# Altium project RM2022拓展板V2.0.PrjPcb
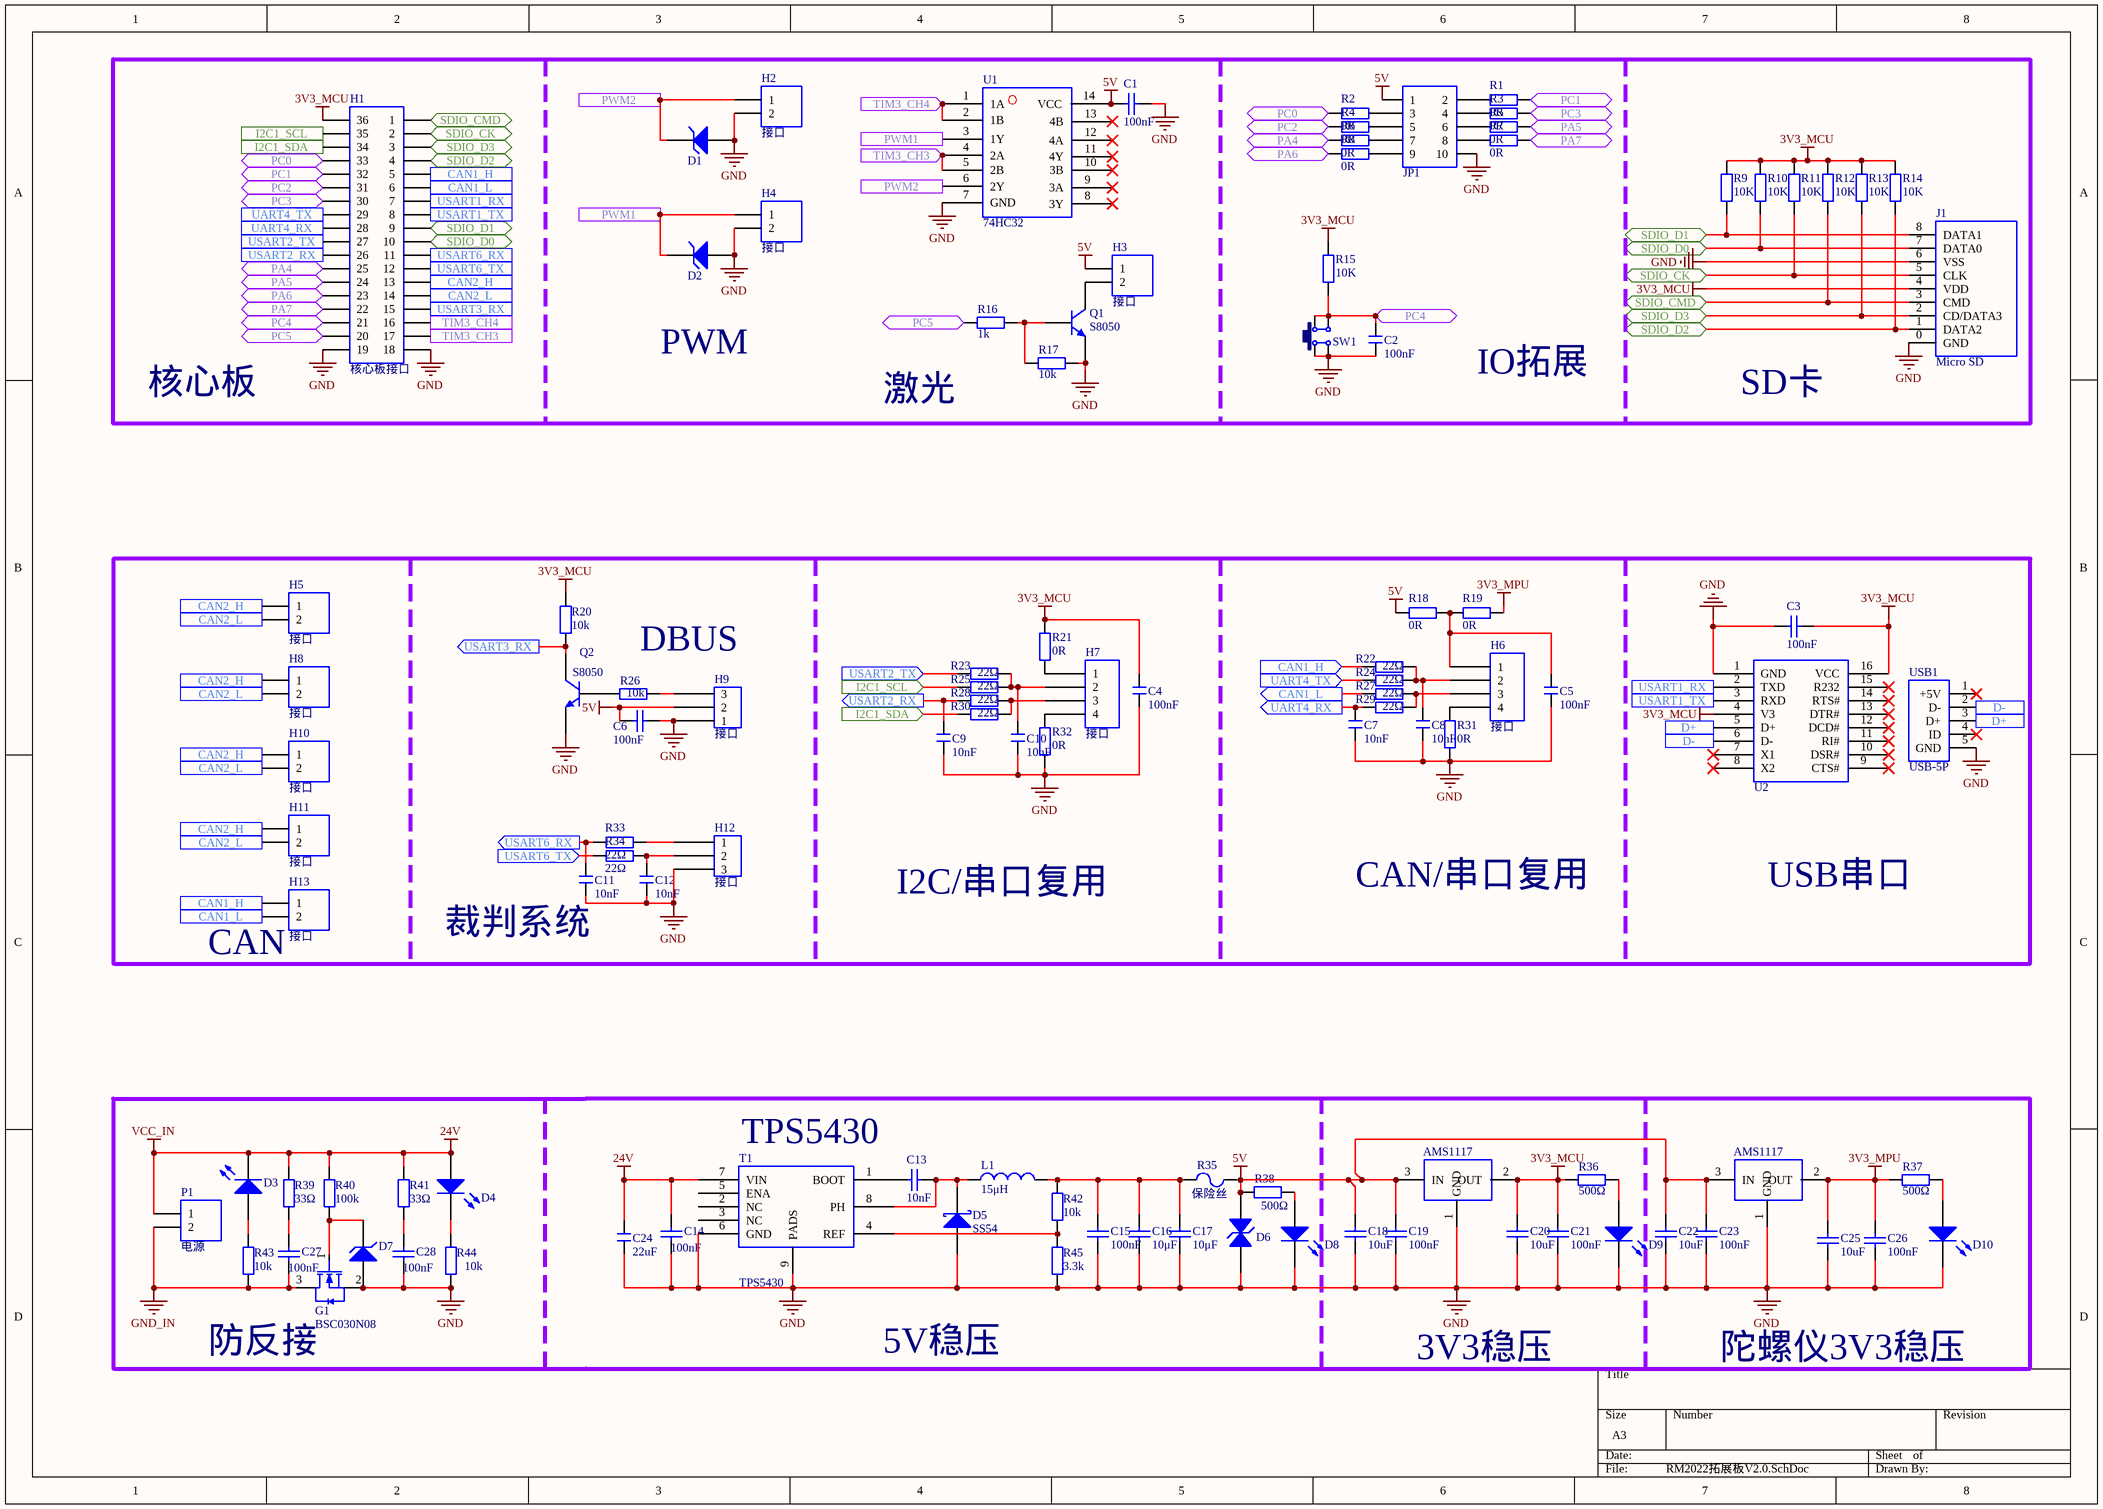
[diagram p0: RM2022拓展板V2.0.SchDoc]
1 sheet, 110 parts. Net scope: flat (ports and power ports of the same name join across sheets).
Board file: RM2022拓展板V2.0.PcbDoc

## Sheet RM2022拓展板V2.0.SchDoc
size A3

### Parts
C1  100nF  [0603_C]
C2  100nF  [C 0402_L]
C3  100nF  [0603_C]
C4  100nF  [C 0402_L]
C5  100nF  [C 0402_L]
C6  100nF  [0603_C]
C7  10nF  [C 0402_L]
C8  10nF  [C 0402_L]
C9  10nF  [C 0402_L]
C10  10nF  [C 0402_L]
C11  10nF  [C 0402_L]
C12  10nF  [C 0402_L]
C13  10nF  [0603_C]
C14  100nF  [0603_C]
C15  100nF  [0603_C]
C16  10μF  [1206_C]
C17  10μF  [1206_C]
C18  10uF  [0603_C]
C19  100nF  [0603_C]
C20  10uF  [0603_C]
C21  100nF  [0603_C]
C22  10uF  [0603_C]
C23  100nF  [0603_C]
C24  22uF  [C 1210_L]
C25  10uF  [0603_C]
C26  100nF  [0603_C]
C27  100nF  [0603_C]
C28  100nF  [0603_C]
D1  稳压二极管  [SOD-123]  (value not drawn)
D2  稳压二极管  [SOD-123]  (value not drawn)
D3  LED  [0603_LED]  (value not drawn)
D4  LED  [0603_LED]  (value not drawn)
D5  SS54  [SS54]
D6  TVS  [DO-214AC]  (value not drawn)
D7  稳压二极管  [SOD-123]  (value not drawn)
D8  LED  [0603_LED]  (value not drawn)
D9  LED  [0603_LED]  (value not drawn)
D10  LED  [0603_LED]  (value not drawn)
G1  BSC030N08  [BSC030N08]
H1  核心板接口  [RM2022核心板V2.0]
H2  接口  [GH1.25 2P]
H3  接口  [GH1.25 2P]
H4  接口  [GH1.25 2P]
H5  接口  [GH1.25 2P]
H6  接口  [GH1.25 4P]
H7  接口  [GH1.25 4P]
H8  接口  [GH1.25 2P]
H9  接口  [GH1.25 3P]
H10  接口  [GH1.25 2P]
H11  接口  [GH1.25 2P]
H12  接口  [GH1.25 3P]
H13  接口  [GH1.25 2P]
J1  Micro SD  [SD卡座短]
JP1  Header 5X2  [HDR2.54-LI-2x5P]  (value not drawn)
L1  15μH  [电感]
P1  电源  [XT30U公头]
Q1  S8050  [SOT-23]
Q2  S8050  [SOT-23]
R1  0R  [R 0402_L]
R2  0R  [R 0402_L]
R3  0R  [R 0402_L]
R4  0R  [R 0402_L]
R5  0R  [R 0402_L]
R6  0R  [R 0402_L]
R7  0R  [R 0402_L]
R8  0R  [R 0402_L]
R9  10K  [R 0402_L]
R10  10K  [R 0402_L]
R11  10K  [R 0402_L]
R12  10K  [R 0402_L]
R13  10K  [R 0402_L]
R14  10K  [R 0402_L]
R15  10K  [R 0402_L]
R16  1k  [0603_R]
R17  10k  [0603_R]
R18  0R  [R 0402_L]
R19  0R  [R 0402_L]
R20  10k  [0603_R]
R21  0R  [R 0402_L]
R22  22Ω  [R 0402_L]
R23  22Ω  [R 0402_L]
R24  22Ω  [R 0402_L]
R25  22Ω  [R 0402_L]
R26  10k  [0603_R]
R27  22Ω  [R 0402_L]
R28  22Ω  [R 0402_L]
R29  22Ω  [R 0402_L]
R30  22Ω  [R 0402_L]
R31  0R  [R 0402_L]
R32  0R  [R 0402_L]
R33  22Ω  [R 0402_L]
R34  22Ω  [R 0402_L]
R35  保险丝  [0805保险丝]
R36  500Ω  [0603_R]
R37  500Ω  [0603_R]
R38  500Ω  [0603_R]
R39  33Ω  [0603_R]
R40  100k  [0603_R]
R41  33Ω  [0603_R]
R42  10k  [0603_R]
R43  10k  [0603_R]
R44  10k  [0603_R]
R45  3.3k  [0603_R]
SW1  6x6x5  [TSW DIP-6*6*6]  (value not drawn)
T1  TPS5430  [TPS5430DDAR]
U1  74HC32  [74HC32]
U2  CH340G  [sop16_L]  (value not drawn)
U3  AMS1117  [1117]
U4  AMS1117  [1117]
USB1  USB-5P  [USB-MICRO_B]

### Ports
CAN1_H (in), CAN1_L (out), CAN2_H (in), CAN2_L (out), D+ (out), D- (out), I2C1_SCL (in), I2C1_SDA (in), PA4 (bidir), PA5 (bidir), PA6 (bidir), PA7 (bidir), PC0 (bidir), PC1 (bidir), PC2 (bidir), PC3 (bidir), PC4 (bidir), PC5 (bidir), PWM1 (in), PWM2 (in), SDIO_CK (bidir), SDIO_CMD (bidir), SDIO_D0 (bidir), SDIO_D1 (bidir), SDIO_D2 (bidir), SDIO_D3 (bidir), TIM3_CH3 (in), TIM3_CH4 (in), UART4_RX (out), UART4_TX (in), USART1_RX (out), USART1_TX (in), USART2_RX (out), USART2_TX (in), USART3_RX (out), USART6_RX (out), USART6_TX (in)

### Nets
3V3_MCU: C3.1 C4.2 C20.2 C21.2 H1.36 J1.4(VDD) R9.1 R10.1 R11.1 R12.1 R13.1 R14.1 R15.1 R20.2 R21.1 R36.2 U2.4(V3) U2.16(VCC) U3.2(OUT)
3V3_MPU: C25.2 C26.2 R19.1 R37.2 U4.2(OUT)
5V: C1.2 C6.2 C18.2 C19.2 C22.2 C23.2 D6.2(K) H3.1 H9.2 JP1.1 R18.2 R35.2 R38.2 U1.14(VCC) U3.3(IN) U4.3(IN)
24V: C14.2 C24.2 D3.2(K) D4.1(A) P1.1 R39.2 R40.2 R41.2 T1.7(VIN)  [also labelled VCC_IN]
GND: C1.1 C2.1 C3.2 C4.1 C5.1 C6.1 C7.1 C8.1 C9.1 C10.1 C11.1 C12.1 C14.1 C15.1 C16.1 C17.1 C18.1 C19.1 C20.1 C21.1 C22.1 C23.1 C24.1 C25.1 C26.1 C28.1 D1.1(A) D2.1(A) D5.1(A) D6.1(A) D7.1(A) D8.2(K) D9.2(K) D10.2(K) G1.2(S) H1.18 H1.19 H2.2 H4.2 H9.1 H12.3 J1.0(GND) J1.6(VSS) JP1.10 Q1.2(E) Q2.2(E) R17.1 R31.2 R32.2 R44.1 R45.1 SW1.1 SW1.4 T1.6(GND) T1.9(PADS) U1.7(GND) U2.1(GND) U3.1(GND) U4.1(GND) USB1.5(GND)
GND_IN: C27.1 G1.3(D) P1.2 R43.1
NetC2_2: C2.2 H1.21 R15.2 SW1.2 SW1.3 ; port PC4
NetC5_2: C5.2 H6.1 R18.1 R19.2
NetC7_2: C7.2 H1.28 R29.2 ; port UART4_RX
NetC8_2: C8.2 H6.2 R22.1 R24.1
NetC9_2: C9.2 H1.26 R28.2 ; port USART2_RX
NetC10_2: C10.2 H7.2 R23.1 R25.1
NetC11_2: C11.2 H1.11 R33.2 ; port USART6_RX
NetC12_2: C12.2 H12.2 R34.1
NetC13_1: C13.1 T1.1(BOOT)
NetC13_2: C13.2 D5.2(K) L1.1 T1.8(PH)
NetC15_2: C15.2 C16.2 C17.2 L1.2 R35.1 R42.2
NetC27_2: C27.2 R39.1
NetC28_2: C28.2 R41.1
NetD1_2: D1.2(K) H2.1 U1.6(2Y) ; port PWM2
NetD2_2: D2.2(K) H4.1 U1.3(1Y) ; port PWM1
NetD3_1: D3.1(A) R43.2
NetD4_2: D4.2(K) R44.2
NetD7_2: D7.2(K) G1.1(G) R40.1
NetD8_1: D8.1(A) R38.1
NetD9_1: D9.1(A) R36.1
NetD10_1: D10.1(A) R37.1
NetH1_1: H1.1 J1.3(CMD) R12.2 ; port SDIO_CMD
NetH1_2: H1.2 J1.5(CLK) R11.2 ; port SDIO_CK
NetH1_3: H1.3 J1.2(CD/DATA3) R13.2 ; port SDIO_D3
NetH1_4: H1.4 J1.1(DATA2) R14.2 ; port SDIO_D2
NetH1_5: H1.5 H13.1 R22.2 ; port CAN1_H
NetH1_6: H1.6 H13.2 R27.2 ; port CAN1_L
NetH1_7: H1.7 U2.2(TXD) ; port USART1_RX
NetH1_8: H1.8 U2.3(RXD) ; port USART1_TX
NetH1_9: H1.9 J1.8(DATA1) R9.2 ; port SDIO_D1
NetH1_10: H1.10 J1.7(DATA0) R10.2 ; port SDIO_D0
NetH1_12: H1.12 R34.2 ; port USART6_TX
NetH1_13: H1.13 H5.1 H8.1 H10.1 H11.1 ; port CAN2_H
NetH1_14: H1.14 H5.2 H8.2 H10.2 H11.2 ; port CAN2_L
NetH1_15: H1.15 Q2.3(C) R20.1 ; port USART3_RX
NetH1_16: H1.16 U1.1(1A) U1.2(1B) ; port TIM3_CH4
NetH1_17: H1.17 U1.4(2A) U1.5(2B) ; port TIM3_CH3
NetH1_20: H1.20 R16.2 ; port PC5
NetH1_22: H1.22 R7.1 ; port PA7
NetH1_23: H1.23 R8.2 ; port PA6
NetH1_24: H1.24 R5.1 ; port PA5
NetH1_25: H1.25 R6.2 ; port PA4
NetH1_27: H1.27 R23.2 ; port USART2_TX
NetH1_29: H1.29 R24.2 ; port UART4_TX
NetH1_30: H1.30 R3.1 ; port PC3
NetH1_31: H1.31 R4.2 ; port PC2
NetH1_32: H1.32 R1.1 ; port PC1
NetH1_33: H1.33 R2.2 ; port PC0
NetH1_34: H1.34 R30.2 ; port I2C1_SDA
NetH1_35: H1.35 R25.2 ; port I2C1_SCL
NetH3_2: H3.2 Q1.3(C)
NetH6_3: H6.3 R27.1 R29.1
NetH6_4: H6.4 R31.1
NetH7_1: H7.1 R21.2
NetH7_3: H7.3 R28.1 R30.1
NetH7_4: H7.4 R32.1
NetH9_3: H9.3 R26.1
NetH12_1: H12.1 R33.1
NetJP1_2: JP1.2 R1.2
NetJP1_3: JP1.3 R2.1
NetJP1_4: JP1.4 R3.2
NetJP1_5: JP1.5 R4.1
NetJP1_6: JP1.6 R5.2
NetJP1_7: JP1.7 R6.1
NetJP1_8: JP1.8 R7.2
NetJP1_9: JP1.9 R8.1
NetQ1_1: Q1.1(B) R16.1 R17.2
NetQ2_1: Q2.1(B) R26.2
NetR42_1: R42.1 R45.2 T1.4(REF)
NetU2_5: U2.5(D+) USB1.3(D+) ; port D+
NetU2_6: U2.6(D-) USB1.2(D-) ; port D-

Not connected (* = marked no-connect by the designer): T1 2(NC) 3(NC) 5(ENA); U1 8(3Y)* 9(3A)* 10(3B)* 11(4Y)* 12(4A)* 13(4B)*; U2 7(X1)* 8(X2)* 9(CTS#)* 10(DSR#)* 11(RI#)* 12(DCD#)* 13(DTR#)* 14(RTS#)* 15(R232)*; USB1 1(+5V)* 4(ID)*

### Notes on the sheet
- PWM
- IO拓展
- 核心板
- 激光
- SD卡
- DBUS
- I2C/串口复用
- CAN/串口复用
- USB串口
- (near H13) CAN
- 裁判系统
- (near T1) TPS5430
- 防反接
- 5V稳压
- 3V3稳压
- 陀螺仪3V3稳压

### Library data of the parts
C1 C3 C6 C14 C15 C18-C23 C25-C28 = 100nF: 瓷片电容; Published: 8-Jun-2000; LatestRevisionDate: 17-Jul-2002; LatestRevisionNote: Re-released for DXP Platform.; Publisher: Altium Limited
C2 C4 C5 C7-C12 C24 = C: 贴片电容; BOM名称: 无极性贴片电容; 淘宝ID: 封装库来自淘宝 ID：黄晶宝石; 联系售后，技术支持: https://shop463601444.taobao.com; 唯一出售店铺网址: https://shop463601444.taobao.com
C13 = 10nF: 瓷片电容; Published: 8-Jun-2000; LatestRevisionDate: 17-Jul-2002; LatestRevisionNote: Re-released for DXP Platform.; Publisher: Altium Limited
C16 C17 = 1206 10uF (105) 10% 50V: 贴片电容; ComponentLink1Description: 供应商链接; ComponentLink1URL: http://www.szlcsc.com/product/details_2200.html; Package: 1206; Supplier: LC; SuppliersPartNumber: C1848
D3 D4 D8-D10 = LED: Typical RED, GREEN, YELLOW, AMBER GaAs LED; Published: 8-Jun-2000; LatestRevisionDate: 17-Jul-2002; LatestRevisionNote: Re-released for DXP Platform.; PackageDocument: Feb-2002; PackageReference: 3.2X1.6X1.1; Publisher: Altium Limited
D5 = SS54: Schottky Diode; Published: 8-Jun-2000; LatestRevisionDate: 17-Jul-2002; LatestRevisionNote: Re-released for DXP Platform.; PackageReference: SMB; Publisher: Altium Limited; PackageDescription: DO-214-AA/SMB; 2 C-Bend Leads; Body 5.3 x 3.6 mm, inc. leads (LxW); Code_JEDEC: DO-214-AA
D6 = SMAJ6.0A: 6V，TVS; ComponentLink1Description: 供应商链接; ComponentLink1URL: http://www.szlcsc.com/product/details_79530.html; Package: SMB/DO-214AA; Supplier: LC; SuppliersPartNumber: C78395
H1 = RM2022核心板V2.0
H2-H5 H8 H10 H11 H13 = GH1.25 2P: Header, 2-Pin; LatestRevisionDate: 17-Jul-2002; LatestRevisionNote: Re-released for DXP Platform.; Publisher: Altium Limited
H6 H7 = GH1.25 4P
H9 H12 = GH1.25 3P
J1 = SD卡 短: Micro SD卡; 版权归属: 黎明电子style; BOM名称: Micro SD卡; 学习资源: https://lmdzstyle.taobao.com/
JP1 = Header 5X2: 5*2P接插件; 版权归属: 封装库来自淘宝 ID：黄晶宝石; BOM名称: 5*2P接插件; 学习资源: https://shop463601444.taobao.com
L1 = 15μH: 贴片电感; Code_IEC: 1005; Published: 8-Jun-2000; LatestRevisionDate: 29-May-2009; LatestRevisionNote: IPC-7351 Footprint Added.; PackageReference: 0402-A; Publisher: Altium Limited; PackageDescription: Chip Inductor; Code_JEITA: 0402
P1 = XT30公头立式: Header, 2-Pin; LatestRevisionDate: 17-Jul-2002; LatestRevisionNote: Re-released for DXP Platform.; Publisher: Altium Limited
Q1 Q2 = NPN三极管: 三极管; ComponentLink1Description: 供应商链接; ComponentLink1URL: http://www.szlcsc.com/product/details_2507.html; Package: SOT-23; Supplier: LC; SuppliersPartNumber: C2150
R1-R15 R18 R19 R21-R25 R27-R34 = R: 贴片电阻; 版权归属: 来自淘宝 ID：黄晶宝石; 封装库来自淘宝卖家 ID：黄晶宝石: 其他店铺购入均为盗版，不享受售后技术支持服务，请立即申请退款; BOM名称: 贴片电阻; 联系售后: https://shop463601444.taobao.com
R16 R17 R20 R26 R36-R44 = 10k: Resistor; Published: 8-Jun-2000; LatestRevisionDate: 17-Jul-2002; LatestRevisionNote: Re-released for DXP Platform.; PackageReference: AXIAL-0.4; Publisher: Altium Limited; PackageDescription: Axial Device, Thru-Hole; 2 Leads; 0.4 in Pin Spacing
R35 = 保险丝: 自恢复保险丝; Published: 8-Jun-2000; LatestRevisionDate: 17-Jul-2002; LatestRevisionNote: Re-released for DXP Platform.; PackageReference: AXIAL-0.3; Publisher: Altium Limited; PackageDescription: Axial Device, Thru-Hole; 2 Leads; 0.3 in Pin Spacing
R45 = 3.3k: Resistor; Published: 8-Jun-2000; LatestRevisionDate: 17-Jul-2002; LatestRevisionNote: Re-released for DXP Platform.; PackageReference: AXIAL-0.4; Publisher: Altium Limited; PackageDescription: Axial Device, Thru-Hole; 2 Leads; 0.4 in Pin Spacing
SW1 = TSW DIP-6x6: 直插6x6轻触开关; 版权归属: 黎明电子style; BOM名称: 直插6x6轻触开关; 学习资源: https://lmdzstyle.taobao.com/
T1 = TPS5430: 24V-5V
U1 = 74HC32: 4路或门
U2 = CH340G: 技术支持，联系售后: 封装库来自淘宝卖家 ID：黄晶宝石; 唯一出售店铺网址: https://shop463601444.taobao.com
USB1 = USB-5P: 微型USB母座; 版权归属: 黎明电子style; BOM名称: 微型USB母座; 学习资源: https://lmdzstyle.taobao.com/
D1 D2 D7 = 稳压二极管: ComponentLink1Description: 供应商链接; ComponentLink1URL: http://www.szlcsc.com/product/details_8541.html; Package: LL-34; Supplier: LC; SuppliersPartNumber: C8062